# Altium schematic sheet LED matrix.SchDoc: Megabit LED Matrix
size A4; DocumentNumber: 2; Revision: 1; SheetNumber: 2; SheetTotal: 3
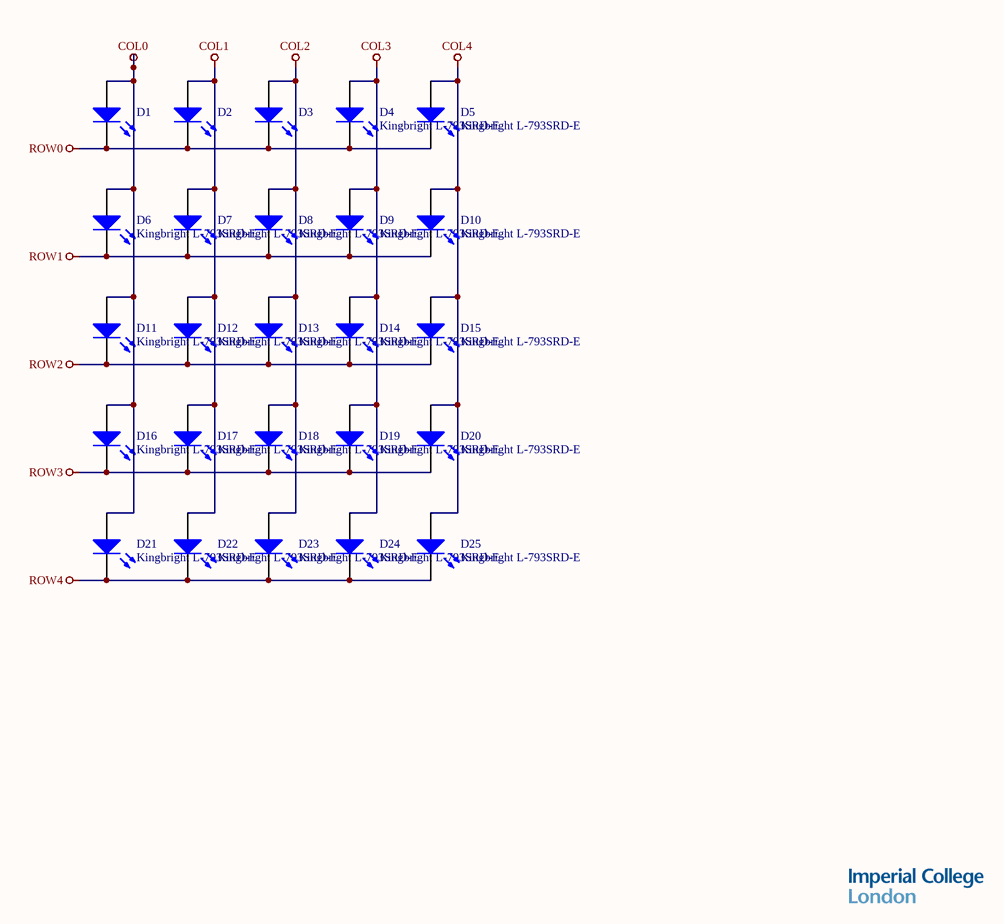
[diagram p0: LED matrix.SchDoc]

## Parts
D1  Visual Communications VAOL-10GAT4  [PCB-lyzc1mpxh94ommceivxw-1]  (value not drawn)
D2  Kingbright L-793SRD-E  [PCB-pjce6c538hbnjhyboevm-1]  (value not drawn)
D3  Kingbright L-793SRD-E  [PCB-pjce6c538hbnjhyboevm-1]  (value not drawn)
D4  Kingbright L-793SRD-E  [PCB-pjce6c538hbnjhyboevm-1]
D5  Kingbright L-793SRD-E  [PCB-pjce6c538hbnjhyboevm-1]
D6  Kingbright L-793SRD-E  [PCB-pjce6c538hbnjhyboevm-1]
D7  Kingbright L-793SRD-E  [PCB-pjce6c538hbnjhyboevm-1]
D8  Kingbright L-793SRD-E  [PCB-pjce6c538hbnjhyboevm-1]
D9  Kingbright L-793SRD-E  [PCB-pjce6c538hbnjhyboevm-1]
D10  Kingbright L-793SRD-E  [PCB-pjce6c538hbnjhyboevm-1]
D11  Kingbright L-793SRD-E  [PCB-pjce6c538hbnjhyboevm-1]
D12  Kingbright L-793SRD-E  [PCB-pjce6c538hbnjhyboevm-1]
D13  Kingbright L-793SRD-E  [PCB-pjce6c538hbnjhyboevm-1]
D14  Kingbright L-793SRD-E  [PCB-pjce6c538hbnjhyboevm-1]
D15  Kingbright L-793SRD-E  [PCB-pjce6c538hbnjhyboevm-1]
D16  Kingbright L-793SRD-E  [PCB-pjce6c538hbnjhyboevm-1]
D17  Kingbright L-793SRD-E  [PCB-pjce6c538hbnjhyboevm-1]
D18  Kingbright L-793SRD-E  [PCB-pjce6c538hbnjhyboevm-1]
D19  Kingbright L-793SRD-E  [PCB-pjce6c538hbnjhyboevm-1]
D20  Kingbright L-793SRD-E  [PCB-pjce6c538hbnjhyboevm-1]
D21  Kingbright L-793SRD-E  [PCB-pjce6c538hbnjhyboevm-1]
D22  Kingbright L-793SRD-E  [PCB-pjce6c538hbnjhyboevm-1]
D23  Kingbright L-793SRD-E  [PCB-pjce6c538hbnjhyboevm-1]
D24  Kingbright L-793SRD-E  [PCB-pjce6c538hbnjhyboevm-1]
D25  Kingbright L-793SRD-E  [PCB-pjce6c538hbnjhyboevm-1]

## Nets
COL0: D1.1(A) D6.1(A) D11.1(A) D16.1(A) D21.1(A)
COL1: D2.1(A) D7.1(A) D12.1(A) D17.1(A) D22.1(A)
COL2: D3.1(A) D8.1(A) D13.1(A) D18.1(A) D23.1(A)
COL3: D4.1(A) D9.1(A) D14.1(A) D19.1(A) D24.1(A)
COL4: D5.1(A) D10.1(A) D15.1(A) D20.1(A) D25.1(A)
ROW0: D1.2(K) D2.2(K) D3.2(K) D4.2(K) D5.2(K)
ROW1: D6.2(K) D7.2(K) D8.2(K) D9.2(K) D10.2(K)
ROW2: D11.2(K) D12.2(K) D13.2(K) D14.2(K) D15.2(K)
ROW3: D16.2(K) D17.2(K) D18.2(K) D19.2(K) D20.2(K)
ROW4: D21.2(K) D22.2(K) D23.2(K) D24.2(K) D25.2(K)

## Notes on the sheet
- Title
- Size:
- Date:
- A4
- Number:
- Time:
- Revision:
- Sheet
- of
- File:

## Library data of the parts
D1 = CMP-95e05c75ddf64a27-1: Led, Red, t-3 (10mm), 480mcd, 640nm; Viewing Angle: 30 °; Forward Voltage: 1.80 V; Wavelength: 655 nm; OctopartID: 95e05c75ddf64a27; Octopart URL: http://octopart.com/vaol-10gat4-visual+communications-10448240; RoHS: Compliant; Mounting Style: Through Hole; Manufacturer Part Number: VAOL-10GAT4; Luminous Intensity: 480 mcd
D2-D25 = CMP-c7440e1cac271883-5: L-793SRD-E, Round Series Red LED, 640 nm 8 mm, Round Lens Through Hole package